# Altium schematic sheet Headphone_Amplifier.SchDoc
size A4; DocumentNumber: 8; SheetNumber: 8; SheetTotal: 11
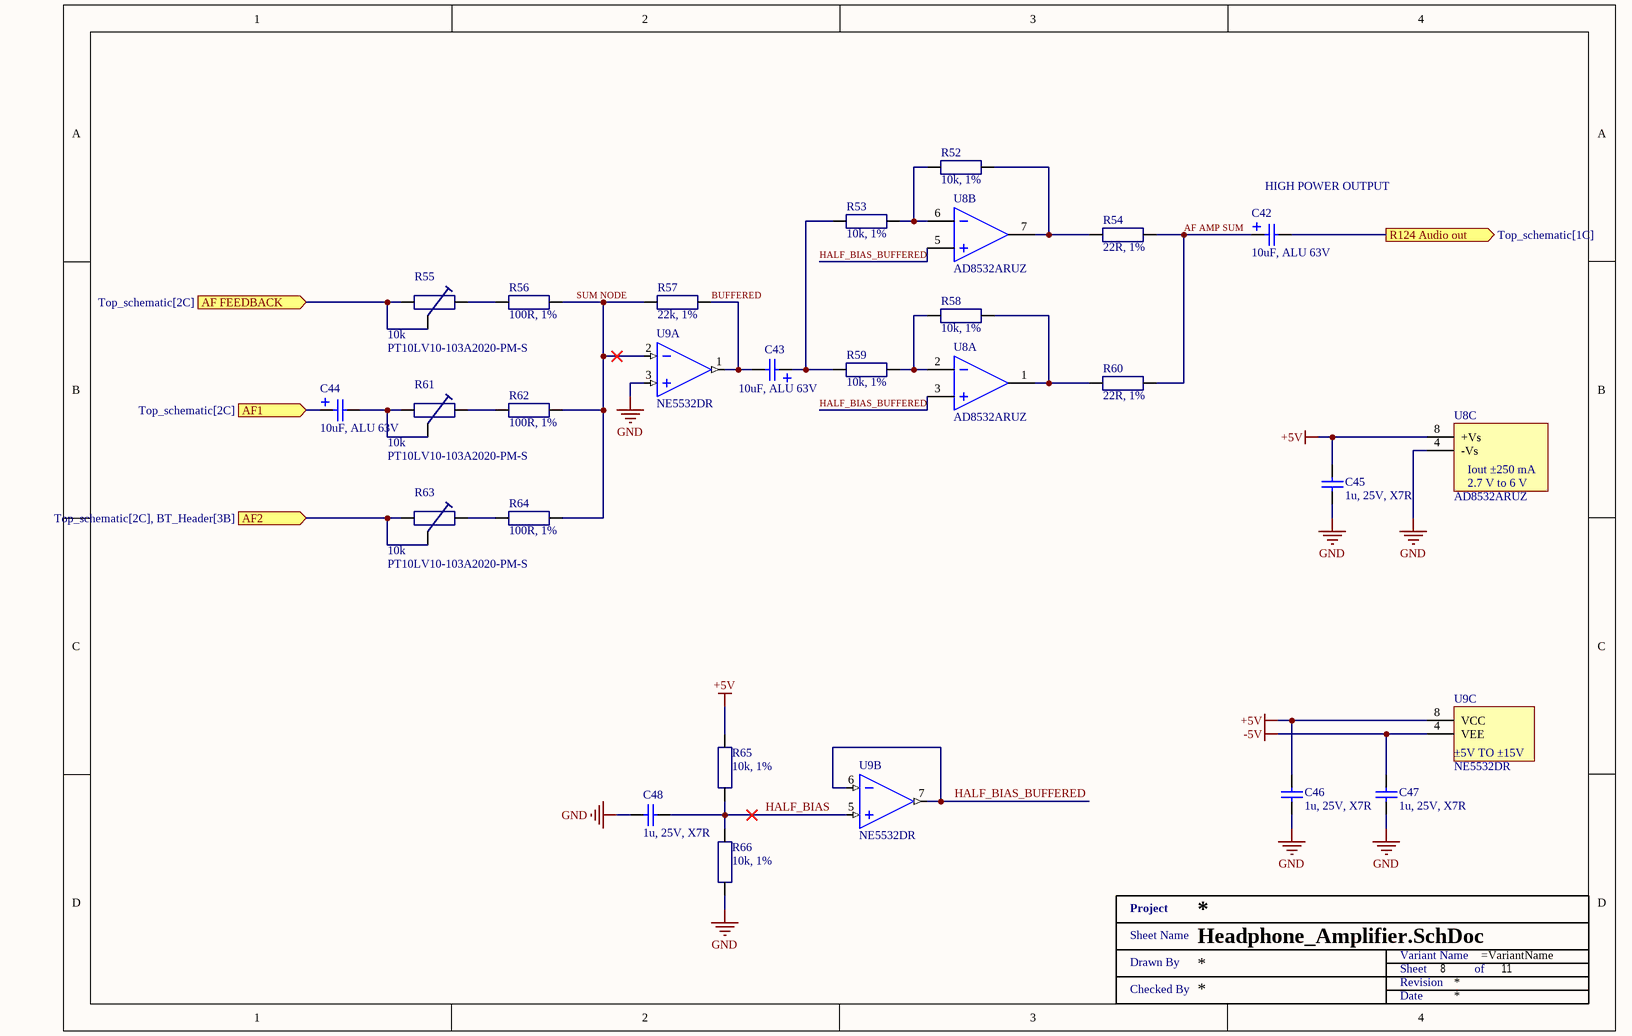
[diagram p0: Headphone_Amplifier.SchDoc]

## Parts
C42  10uF, ALU 63V  [WCAP-ATLI_5x11x2]
C43  10uF, ALU 63V  [WCAP-ATLI_5x11x2]
C44  10uF, ALU 63V  [WCAP-ATLI_5x11x2]
C45  1u, 25V, X7R  [SMD0603]
C46  1u, 25V, X7R  [SMD0603]
C47  1u, 25V, X7R  [SMD0603]
C48  1u, 25V, X7R  [SMD0603]
R52  10k, 1%  [SMD0603 - R]
R53  10k, 1%  [SMD0603 - R]
R54  22R, 1%  [SMD0603 - R]
R55  10k  [V10]
R56  100R, 1%  [SMD0603 - R]
R57  22k, 1%  [SMD0603 - R]
R58  10k, 1%  [SMD0603 - R]
R59  10k, 1%  [SMD0603 - R]
R60  22R, 1%  [SMD0603 - R]
R61  10k  [V10]
R62  100R, 1%  [SMD0603 - R]
R63  10k  [V10]
R64  100R, 1%  [SMD0603 - R]
R65  10k, 1%  [SMD0603 - R]
R66  10k, 1%  [SMD0603 - R]
U8  AD8532ARUZ  [TSSOP08]  (parts A,B,C of 3)
U9  NE5532DR  [SOIC08]  (parts A,B,C of 3)
XX?  Title 1  (value not drawn)  (graphical)

## Ports
AF1 (in, see Top_schematic[2C]), AF2 (in, see Top_schematic[2C], BT_Header[3B]), AF FEEDBACK (in, see Top_schematic[2C]), R124 Audio out (out, see Top_schematic[1C])

## Nets
+5V: C45.2 C46.2 R65.1 U8.8(+Vs) U9.8(VCC)
-5V: C47.2 U9.4(VEE)
GND: C45.1 C46.1 C47.1 C48.1 R66.2 U8.4(-Vs) U9.3(+IN_A)
AF1: C44.1 ; port AF1
AF2: R63.1 R63.2 ; port AF2
AF AMP SUM: C42.1 R54.2 R60.2
AF FEEDBACK: R55.1 R55.2 ; port AF FEEDBACK
BUFFERED: C43.2 R57.2 U9.1(OUT_A)
HALF_BIAS: C48.2 R65.2 R66.1 U9.5(+IN_B)
HALF_BIAS_BUFFERED: U8.3(+INa) U8.5(+INb) U9.6(-IN_B) U9.7(OUT_B)
R124 Audio out: C42.2 ; port R124 Audio out
SUM NODE: R56.2 R57.1 R62.2 R64.2 U9.2(-IN_A)
NetC43_1: C43.1 R53.1 R59.1
NetC44_2: C44.2 R61.1 R61.2
NetR52_1: R52.1 R53.2 U8.6(-INb)
NetR52_2: R52.2 R54.1 U8.7(OUTb)
NetR55_3: R55.3 R56.1
NetR58_1: R58.1 R59.2 U8.2(-INa)
NetR58_2: R58.2 R60.1 U8.1(OUTa)
NetR61_3: R61.3 R62.1
NetR63_3: R63.3 R64.1

## Notes on the sheet
- (near C42) HIGH POWER OUTPUT
- (in symbol AD8532ARUZ-REEL, part C) Iout ±250 mA; 2.7 V to 6 V
- (in symbol NE5532DR, part C) ±5V TO ±15V
- (in symbol Title 1) Project; Sheet Name; Variant Name; Drawn By; Sheet; of; Revision; Checked By; Date

## Library data of the parts
C42-C44 = 860080772001: WURTH ELEKTRONIK - 860080772001 - CAP, ALU ELEC, 10UF, 63V, RADIAL; Ripple Current: 135mA @ 100kHz; Capacitance: 10u; Manufacturer: WURTH ELEKTRONIK; Manufacturer Part Number: 860080772001; RoHS: YES; Stock 1: 553; Pricing 1: 1=0.0957, 3=0.091, 5=0.0863, 10=0.0825, 20=0.0786, 50=0.0692, 250=0.0647, 500=0.0564 (GBP); ComponentLink1URL: http://www.farnell.com/datasheets/1879798.pdf; ComponentLink1Description: http://www.farnell.com/datasheets/1879798.pdf; Voltage Rating: 63V; Stock 3: 2136; Pricing 3: 1=0.62, 50=0.335, 100=0.289, 250=0.259, 500=0.235, 1500=0.202, 7500=0.182, 15000=0.178 (GBP); ComponentLink2URL: http://www.farnell.com/datasheets/2065186.pdf; ComponentLink2Description: http://www.farnell.com/datasheets/2065186.pdf; Supplier 1: Mouser; Supplier Part Number 1: 710-860080772001; Supplier 2: Farnell; Supplier Part Number 2: 2465955; Supplier 3: Digi-Key; Supplier Part Number 3: 732-9121-1-ND
C45-C48 = CGA3E1X7R1E105K080AC: CAP CER 1UF 25V X7R 0603; Manufacturer: TDK Corporation; Tolerance: ±10%; Manufacturer Part Number: CGA3E1X7R1E105K080AC; RoHS: RoHS Compliant; Category: Capacitors; Stock 1: 109509; Pricing 1: 1=0.2, 10=0.135, 100=0.0686, 500=0.04696, 1000=0.04154 (USD); Packaging: Cut Tape (CT); Part Status: Active; Voltage - Rated: 25V; Temperature Coefficient: X7R; Operating Temperature: -55°C ~ 125°C; Features: -; Ratings: AEC-Q200; Applications: Automotive; Failure Rate: -; Mounting Type: Surface Mount, MLCC; Package / Case: 0603 (1608 Metric); Size / Dimension: 0.063" L x 0.032" W (1.60mm x 0.80mm); Height - Seated (Max): -; Thickness (Max): 0.035" (0.90mm); Lead Spacing: -; Lead Style: -; ComponentLink1URL: https://product.tdk.com/info/en/catalog/datasheets/mlcc_automotive_general_en.pdf; ComponentLink1Description: https://product.tdk.com/info/en/catalog/datasheets/mlcc_automotive_general_en.pdf; Capacitance: 1u; Supplier 1: Mouser; Supplier Part Number 1: 810-CGA3E1X7R1E105K; Supplier 2: Farnell; Supplier Part Number 2: 2346962; Supplier 3: Digi-Key; Supplier Part Number 3: 445-6931-1-ND
R52 R53 R58 R59 R65 R66 = RC0603FR-0710KL: YAGEO (PHYCOMP) - RC0603FR-0710KL - RES, THICK FILM, 10K, 1%, 0.1W, 0603; Voltage Rating: 50; Resistor Case Style: 0603 [1608 Metric]; Power Rating: 100; Product Range: RC Series; Temperature Coefficient: ± 100; SVHC: No SVHC (20-Jun-2016); Manufacturer: YAGEO (PHYCOMP); Manufacturer Part Number: RC0603FR-0710KL; RoHS: YES; Stock 1: 9995; Pricing 1: 5000=0.0025, 25000=0.0014, 50000=0.0013 (GBP); Resistance: 10k; Resistance Tolerance: ± 1%; Packaging: Tape & Reel; Resistor Element Material: Thick Film; Automotive Qualification Standard: -; MSL: MSL 1 - Unlimited<!--FANDB--><div class="features-and-benefits-container"><div class="features-and-benefits-desc-container"><span class="features-and-benefits-container-desc">SMD Chip Resistor, Thick Film, 10 kohm, 50 V, 0603 [1608 Metric], 100 mW, ± 1; ComponentLink1URL: http://past.yageo.com/pdf/PYu-R_Packing_6.pdf; ComponentLink1Description: http://past.yageo.com/pdf/PYu-R_Packing_6.pdf; ComponentLink2URL: http://www.farnell.com/datasheets/2167052.pdf; ComponentLink2Description: http://www.farnell.com/datasheets/2167052.pdf; Supplier 1: Mouser; Supplier Part Number 1: 603-RC0603FR-0710KL; Supplier 2: Farnell; Supplier Part Number 2: 2421850; Supplier 3: Digi-Key; Supplier Part Number 3: 311-10.0KHRCT-ND
R54 R60 = RC0603FR-0722RL: YAGEO (PHYCOMP) - RC0603FR-0722RL - RES, THICK FILM, 22R, 1%, 0.1W, 0603; Voltage Rating: 50; Resistor Case Style: 0603 [1608 Metric]; Power Rating: 100; Product Range: RC Series; Temperature Coefficient: ± 100; SVHC: No SVHC (20-Jun-2016); External Depth: 0.45; External Length / Height: 1.6; External Width: 0.8; Full Power Rating Temperature: 70; No. of Pins: 2; Reel Quantity: 5000; Resistor Mounting: Surface Mount Device; Voltage Rating V DC: 50V<!--FANDB--><div class="features-and-benefits-container"><div class="features-and-benefits-desc-container"><span class="features-and-benefits-container-desc">SMD Chip Resistor, Thick Film, 22 ohm, 50 V, 0603 [1608 Metric], 100 mW, ± 1%, RC Series</span></div><div class="features-and-benefits-description"><span class="features-benefits-value">The Yageo RC_L series resistors are general purpose thick film chip resistors with lead free terminations made by thick film process. The resistance range includes E24 and E96 decade values from 1ohm to 100Mohm. These resistors are constructed on top of a high grade ceramic body.</span></div><div class="features-and-benefits-list"><ul class="features-and-benefits-list-list"><li class="features-and-benefits-list-item">EIA 0075, 0100, 0201, 0402, 0603, 0805, 1206, 1210, 1218, 2010, 2512 case sizes available</li><li class="features-and-benefits-list-item">Small chip sizes save PCB space</li><li class="features-and-benefits-list-item">Rated voltage range of 10V to 200V</li><li class="features-and-benefits-list-item">Maximum power rating of 2W</li><li class="features-and-benefits-list-item">Available in ±0.1%, ±0.5%, ±1% and ±5% tolerance</li><li class="features-and-benefits-list-item">High component and equipment reliability</li><li class="features-and-benefits-list-item">Forbidden materials are not used in products/production</li><li class="features-and-benefits-list-item">-55°C to 155°C temperature range for RC0402 to RC2512 and -55°C to 125°C for RC0075 to RC0201; Manufacturer: YAGEO (PHYCOMP); Manufacturer Part Number: RC0603FR-0722RL; RoHS: YES; Stock 1: 33025; Pricing 1: 10=0.0102, 100=0.0068, 500=0.0051, 1000=0.0041, 2500=0.0034 (GBP); Resistance: 22R; Resistance Tolerance: ± 1%; Packaging: Cut Tape; Resistor Element Material: Thick Film; Automotive Qualification Standard: -; MSL: MSL 1 - Unlimited; Operating Temperature Max: 155; Operating Temperature Min: -55; Operating Temperature Range: -55°C to +155; Temperature Coeff. +: 100; Temperature Coeff. -: 100; Tolerance +: 1%; Tolerance -: 1%; ComponentLink1URL: http://www.farnell.com/datasheets/2167052.pdf; ComponentLink1Description: http://www.farnell.com/datasheets/2167052.pdf; ComponentLink2URL: http://www.farnell.com/cad/1555248.zip; ComponentLink2Description: http://www.farnell.com/cad/1555248.zip; Supplier 1: Mouser; Supplier Part Number 1: 603-RC0603FR-0722RL; Supplier 2: Farnell; Supplier Part Number 2: 9238280; Supplier 3: Digi-Key; Supplier Part Number 3: 311-22.0HRCT-ND
R55 R61 R63 = PT10LV10-103A2020-PM-S: Resistor Carbon Film Trimmer Top Adjustment 10K Ohm 20% 3/20W 1 Turn PC Pin Through Hole Bulk; Manufacturer: Amphenol; Supplier 1: Mouser; Supplier Part Number 1: 531-PT10LV113A22PMS; Stock 1: 8041; Pricing 1: 1=0.5, 10=0.451, 50=0.396, 100=0.374, 1000=0.296, 10000=0.268 (USD); Manufacturer Part Number: PT10LV10-103A2020-PM-S
R56 R62 R64 = MCWR06X1000FTL: MULTICOMP - MCWR06X1000FTL - RES, THICK FILM, 100R, 1%, 0.1W, 0603; Voltage Rating: 50; Resistor Case Style: 0603 [1608 Metric]; Power Rating: 100; Product Range: MCWR Series; Temperature Coefficient: ± 100; SVHC: No SVHC (07-Jul-2017)<!--FANDB--><div class="features-and-benefits-container"><div class="features-and-benefits-desc-container"><span class="features-and-benefits-container-desc">SMD Chip Resistor, Thick Film, 100 ohm, 50 V, 0603 [1608 Metric], 100 mW, ± 1%, MCWR Series</span></div><div class="features-and-benefits-description"><span class="features-benefits-value">The MCWR06X1000FTL is a thick film Chip Resistor with 0603 chip format. The resistor is constructed in a high grade ceramic body (aluminium oxide). Internal metal electrodes are added at each end and connected by a resistive paste that is applied to the top surface of the substrate. The composition of the paste is adjusted to give the approximate resistance required and the value is trimmed to within tolerance by laser cutting of this resistive layer.</span></div><div class="features-and-benefits-list"><ul class="features-and-benefits-list-list"><li class="features-and-benefits-list-item">High reliability and stability</li><li class="features-and-benefits-list-item">Reduced size of final equipment</li><li class="features-and-benefits-list-item">Lower assembly costs</li><li class="features-and-benefits-list-item">Higher component and equipment reliability</li></ul></div><div class="features-and-benefits-applications"><ul class="features-and-benefits-value"><li class="features-and-benefits-list-item">Consumer Electronics</li><li class="features-and-benefits-list-item">Computers & Computer Peripherals</li><li class="features-and-benefits-list-item">Communications & Networking</li></ul></div></div>; Supplier 1: Farnell; Supplier Part Number 1: 2447227; Manufacturer: MULTICOMP; Manufacturer Part Number: MCWR06X1000FTL; RoHS: Y-EX; Stock 1: 246691; Pricing 1: 10=0.0032, 100=0.002, 500=0.0013, 1000=0.0011, 2500=0.0009 (GBP); Resistance: 100R; Resistance Tolerance: ± 1%; Packaging: Cut Tape; Resistor Element Material: Thick Film; Automotive Qualification Standard: -; ComponentLink1URL: http://www.farnell.com/datasheets/1849611.pdf; ComponentLink1Description: http://www.farnell.com/datasheets/1849611.pdf
R57 = RC0603FR-1322KL: Res Thick Film 0603 22K Ohm 1% 0.1W(1/10W) ±100ppm/C Molded SMD Paper T/R; Manufacturer: Yageo; Temperature Coefficient: 100ppm/°C; Power Rating: 100mW; Voltage Rating: 50V; Supplier 1: Mouser; Supplier Part Number 1: 603-RC0603FR-1322KL; Manufacturer Part Number: RC0603FR-1322KL; RoHS: Yes; Category: Chip SMD Resistors; Stock 1: 142305; Pricing 1: 1=0.10000, 10=0.01800, 100=0.00600, 1000=0.00500, 2500=0.00300, 10000=0.00300 (USD); Case/Package: 0603; Case Code (Imperial): 0603; Case Code (Metric): 1608; Min Operating Temperature: -55°C; Max Operating Temperature: 155°C; Composition: Thick Film; Termination: SMD/SMT; Military Standard: Not; Resistance: 22k; Tolerance: 1%; Packaging: Tape and Reel; Length: 1.6mm; Depth: 0.8mm; ComponentLink1URL: http://www.mouser.com/ds/2/447/RC0603-272842.pdf?src-supplier=Mouser; ComponentLink1Description: http://www.mouser.com/ds/2/447/RC0603-272842.pdf?src-supplier=Mouser; ComponentLink2URL: http://components.arrow.com/part/dataview/0323_03827690?src-supplier=Arrow+Europe; ComponentLink2Description: http://components.arrow.com/part/dataview/0323_03827690?src-supplier=Arrow+Europe; Supplier 2: Avnet; Supplier Part Number 2: RC0603FR-1322KL
U8 = AD8532ARUZ-REEL: Low Cost, 250 mA Output, Single-Supply Amplifiers, DUAL, CMOS, TSSOP, 8PIN, PLASTIC; Manufacturer: Analog Devices; Min Supply Voltage: 2.7V; Max Supply Voltage: 6V; Voltage Gain: 98.06dB; Unity Gain Bandwidth Product: 3MHz; Common Mode Rejection Ratio: 47dB; Slew Rate: 5V/µs; Number of Circuits: 2; Input Bias Current: 5pA; Input Offset Voltage (Vos): 25mV; Operating Supply Current: 2.5mA; Output Current per Channel: 250mA; Input Voltage Noise Density: 45nV/sqrt Hz; Power Supply Rejection Ratio (PSRR): 55dB; Quiescent Current: 1.25mA; Settling Time: 1.4us; Amplifier Type: GENERAL PURPOSE; Supplier 1: Mouser; Supplier Part Number 1: 584-AD8532ARUZ-R; Manufacturer Part Number: AD8532ARUZ-REEL; RoHS: Yes; Category: Amplifiers - Op Amps, Buffer, Instrumentation; Stock 1: 16323; Pricing 1: 1=1.55, 10=1.32, 50=1.32, 100=1.12, 1000=0.762, 10000=0.648 (USD); Case/Package: TSSOP; Pins: 8; Contact Plating: Tin,Matte; Min Operating Temperature: -40°C; Max Operating Temperature: 85°C; Packaging: Tape and Reel; Package Quantity: 2500; Gain Bandwidth Product: 3MHz; Number of Channels: 2; Number of Elements: 2; Number of Amplifiers: 2; Series: -; Technology: CMOS; Lead Free: Contains Lead; RoHS Compliant: Yes; ComponentLink1URL: https://datasheet.ciiva.com/45425/ad8531-8532-8534-45425830.pdf?src-supplier=Digi-Key; ComponentLink1Description: https://datasheet.ciiva.com/45425/ad8531-8532-8534-45425830.pdf?src-supplier=Digi-Key; Supplier 2: Farnell; Supplier Part Number 2: 4019791RL; Supplier 3: Digi-Key; Supplier Part Number 3: 505-AD8532ARUZ-REELCT-ND
U9 = NE5532DR: 2-channel, 10-MHz, 26-V output swing, low-noise audio op amp 8-SOIC 0 to 70; Manufacturer: Texas Instruments; Bandwidth: 10MHz; Number of Channels: 2; Voltage Gain: 100dB; Min Dual Supply Voltage: 5V; Max Dual Supply Voltage: 15V; Output Current: 38mA; Nominal Supply Current: 16mA; Common Mode Rejection Ratio: 70dB; Slew Rate: 9V/µs; Max I/O Voltage: 4mV; Input Bias Current: 800nA; Operating Supply Current: 8mA; Dual Supply Voltage: 9V; Parameter 1: Jellybean; Supplier 1: Mouser; Supplier Part Number 1: 595-NE5532DR; Manufacturer Part Number: NE5532DR; RoHS: Yes; Category: Amplifiers - Op Amps, Buffer, Instrumentation; Pricing 1: 1=0.60000, 10=0.51400, 50=0.51400, 100=0.35600, 500=0.30100, 1000=0.23300, 2500=0.21100, 10000=0.21100 (USD); Case/Package: D; Number of Pins: 8; Contact Plating: Gold; Min Operating Temperature: 0°C; Max Operating Temperature: 70°C; Packaging: Tape and Reel; Number of Circuits: 2; Gain Bandwidth Product: 10MHz; Unity Gain Bandwidth Product: 10MHz; Package Quantity: 1; Nominal Gain Bandwidth Product: 10MHz; Input Offset Voltage (Vos): 4mV; Output Current per Channel: 38mA; Number of Elements: 2; Max Supply Voltage: 15V; Number of Amplifiers: 2; Length: 4.9mm; Width: 3.91mm; Height: 1.58mm; Radiation Hardening: No; Lead Free: Lead Free; RoHS Compliant: Yes; REACH SVHC: No SVHC; ComponentLink1URL: https://datasheet.ciiva.com/1796/ne5532-1796190.pdf?src-supplier=Digi-Key; ComponentLink1Description: https://datasheet.ciiva.com/1796/ne5532-1796190.pdf?src-supplier=Digi-Key; ComponentLink2URL: https://datasheet.ciiva.com/1796/ne5532-1796189.pdf?src-supplier=Digi-Key; ComponentLink2Description: https://datasheet.ciiva.com/1796/ne5532-1796189.pdf?src-supplier=Digi-Key; ComponentLink3URL: https://datasheet.ciiva.com/1796/ne5532-1796191.pdf?src-supplier=Digi-Key; ComponentLink3Description: https://datasheet.ciiva.com/1796/ne5532-1796191.pdf?src-supplier=Digi-Key; Supplier 2: Farnell; Supplier Part Number 2: 3117312; Supplier 3: Digi-Key; Supplier Part Number 3: 296-13622-6-ND